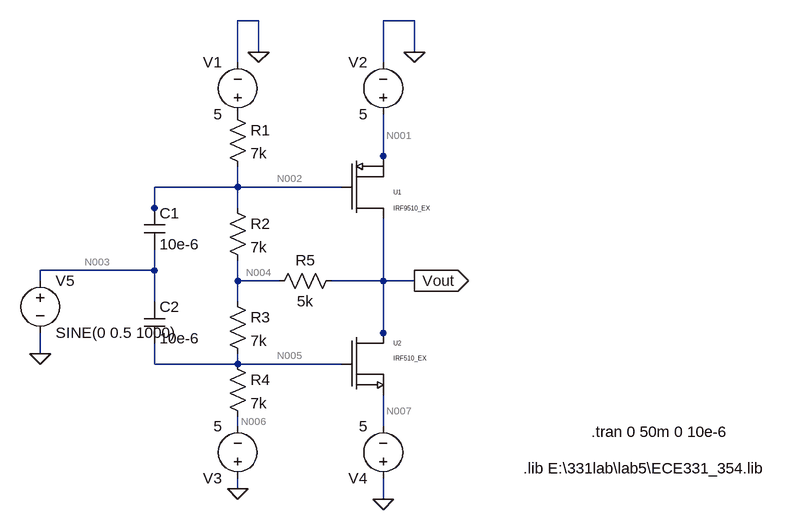
[diagram p0: schematic test2.asc]
test2.asc, the LTspice schematic file:
Version 4
SHEET 1 1088 852
WIRE 240 96 208 96
WIRE 480 96 432 96
WIRE 240 144 240 96
WIRE 480 144 480 96
WIRE 208 160 208 96
WIRE 432 160 432 96
WIRE 432 304 432 240
WIRE 432 320 432 304
WIRE 208 352 208 320
WIRE 208 352 80 352
WIRE 368 352 208 352
WIRE 80 384 80 352
WIRE 208 384 208 352
WIRE 80 400 80 384
WIRE 80 480 80 448
WIRE 80 480 -96 480
WIRE -96 496 -96 480
WIRE 208 496 208 464
WIRE 272 496 208 496
WIRE 432 496 432 400
WIRE 432 496 352 496
WIRE 480 496 432 496
WIRE 80 528 80 480
WIRE 208 528 208 496
WIRE 432 576 432 496
WIRE 432 592 432 576
WIRE -96 608 -96 576
WIRE 80 624 80 592
WIRE 208 624 208 608
WIRE 208 624 80 624
WIRE 368 624 208 624
WIRE 208 720 208 704
WIRE 432 720 432 672
WIRE 208 816 208 800
WIRE 432 832 432 800
FLAG 208 816 0
FLAG 432 832 0
FLAG 240 144 0
FLAG 480 144 0
FLAG -96 608 0
FLAG 480 496 Vout
IOPIN 480 496 Out
SYMBOL voltage 208 256 R180
WINDOW 0 24 96 Left 2
WINDOW 3 24 16 Left 2
WINDOW 123 0 0 Left 2
WINDOW 39 0 0 Left 2
SYMATTR InstName V1
SYMATTR Value 5
SYMBOL voltage 432 256 R180
WINDOW 0 24 96 Left 2
WINDOW 3 24 16 Left 2
WINDOW 123 0 0 Left 2
WINDOW 39 0 0 Left 2
SYMATTR InstName V2
SYMATTR Value 5
SYMBOL voltage 208 816 R180
WINDOW 123 0 0 Left 2
WINDOW 39 0 0 Left 2
SYMATTR InstName V3
SYMATTR Value 5
SYMBOL voltage 432 816 R180
WINDOW 123 0 0 Left 2
WINDOW 39 0 0 Left 2
SYMATTR InstName V4
SYMATTR Value 5
SYMBOL res 192 224 R0
SYMATTR InstName R1
SYMATTR Value 7k
SYMBOL res 192 368 R0
SYMATTR InstName R2
SYMATTR Value 7k
SYMBOL res 192 512 R0
SYMATTR InstName R3
SYMATTR Value 7k
SYMBOL res 192 608 R0
SYMATTR InstName R4
SYMATTR Value 7k
SYMBOL cap 64 384 R0
SYMATTR InstName C1
SYMATTR Value 10e-6
SYMATTR SpiceLine V=4 Irms=8.88 Rser=0.00522854 Lser=0
SYMBOL cap 64 528 R0
SYMATTR InstName C2
SYMATTR Value 10e-6
SYMBOL res 368 480 R90
WINDOW 0 0 56 VBottom 2
WINDOW 3 32 56 VTop 2
SYMATTR InstName R5
SYMATTR Value 5k
SYMBOL IRF9510 368 304 R0
SYMATTR InstName U1
SYMBOL IRF510 368 576 R0
SYMATTR InstName U2
SYMBOL voltage -96 480 R0
WINDOW 123 0 0 Left 2
WINDOW 39 0 0 Left 2
SYMATTR InstName V5
SYMATTR Value SINE(0 0.5 1000)
TEXT 752 728 Left 2 !.tran 0 50m 0 10e-6
TEXT 648 784 Left 2 !.lib E:\\331lab\\lab5\\ECE331_354.lib

The netlist it stands for:
* test2.asc
V1 P001 0 5
V2 N001 0 5
V3 0 N006 5
V4 0 N007 5
R1 P001 N002 7k
R2 N002 N004 7k
R3 N004 N005 7k
R4 N005 N006 7k
C1 N002 N003 10e-6 V=4 Irms=8.88 Rser=0.00522854 Lser=0
C2 N003 N005 10e-6
R5 Vout N004 5k
XU1 Vout N002 N001 IRF9510_EX  ; pins D G S
XU2 Vout N005 N007 IRF510_EX  ; pins D G S
V5 N003 0 SINE(0 0.5 1000)
.tran 0 50m 0 10e-6
.lib E:\331lab\lab5\ECE331_354.lib
.backanno
.end

* Results of the author's LTspice run, read from the files saved beside the schematic
* Operating Point, zero values left out:
*   V(p001) = 5 V
*   V(n001) = 5 V
*   V(n006) = -5 V
*   V(n007) = -5 V
*   V(n002) = 3.835 V
*   V(n004) = 2.67 V
*   V(n005) = -1.165 V
*   V(vout) = 4.576 V
*   I(R5) = 381.4 µA
*   I(R4) = 547.8 µA
*   I(R3) = 547.8 µA
*   I(R2) = 166.5 µA
*   I(R1) = 166.5 µA
*   I(V4) = -76.89 µA
*   I(V3) = -547.8 µA
*   I(V2) = -458.3 µA
*   I(V1) = -166.5 µA
*   Ix(u1:1) = -458.3 µA
*   Ix(u1:3) = 458.3 µA
*   Ix(u2:1) = 76.89 µA
*   Ix(u2:2) = -5.742 pA
*   Ix(u2:3) = -76.89 µA
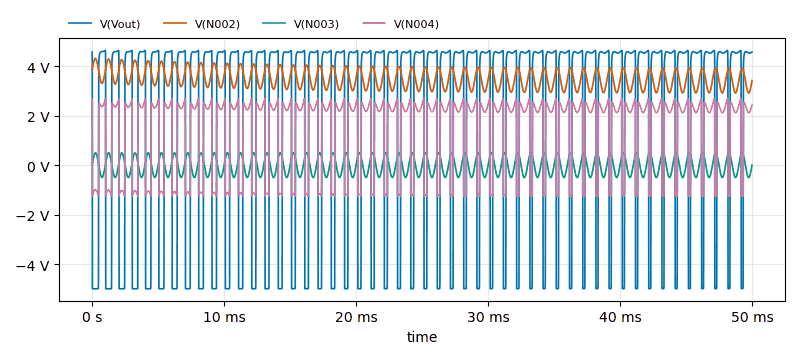
[diagram p1: Transient Analysis of test2.asc, plotted from the saved traces]
* Transient Analysis, 1 run:
*   V(Vout): min -4.998 V, max 4.643 V, average 2.11 V, rms 4.636 V, last 4.581 V
*   V(N002): min 2.92 V, max 4.319 V, average 3.524 V, rms 3.543 V, last 3.423 V
*   V(N003): min -499.5 mV, max 499.5 mV, average 126.6 µV, rms 353.2 mV, last 0 V
*   V(N004): min -1.247 V, max 2.692 V, average 1.471 V, rms 2.132 V, last 2.429 V